# Altium schematic sheet GP_Power_Circuit_Sheet.SchDoc
size B; SheetNumber: 1; SheetTotal: 3
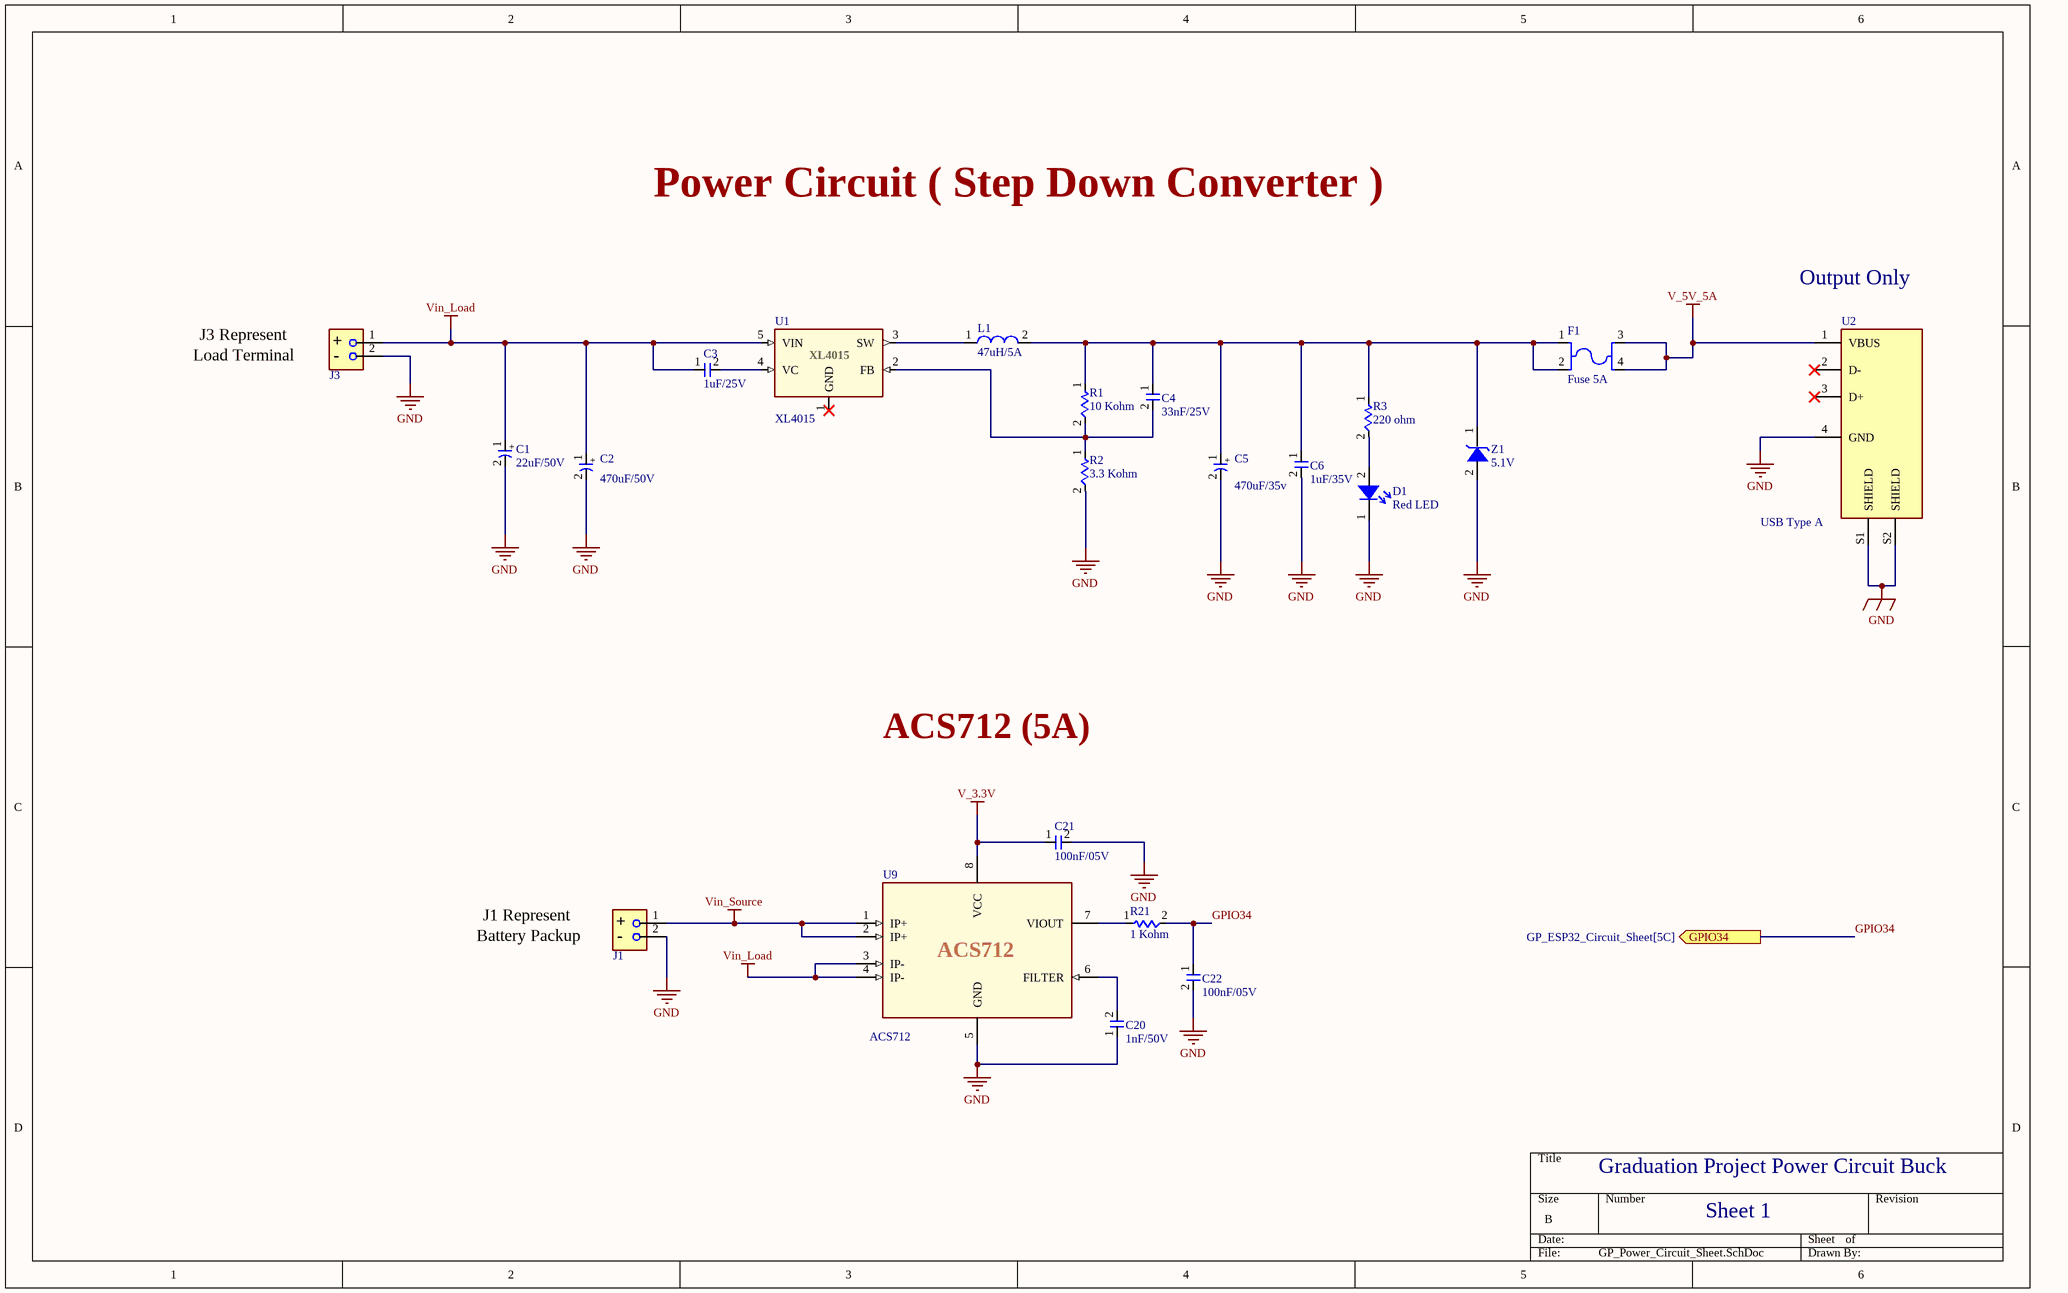
[diagram p0: GP_Power_Circuit_Sheet.SchDoc]

## Parts
C1  22uF/50V  [Electrolytic Capacitor 22UF]
C2  470uF/50V  [Capacitor 470uF/50v]
C3  1uF/25V  [Capacitor 1uF (1206)]
C4  33nF/25V  [Capacitor 33nF]
C5  470uF/35v  [Capacitor 470uF/35v]
C6  1uF/35V  [Capacitor 1uF (1206)]
C20  1nF/50V  [Capacitor 1nF]
C21  100nF/05V  [Capacitor 1uF (1206)]
C22  100nF/05V  [Capacitor 1uF (1206)]
D1  Red LED  [Red Led]
F1  Fuse 5A  [Fuse 5A]
J1  terminal block connector  [Battery Connector]  (value not drawn)
J3  terminal block connector  [Battery Connector]  (value not drawn)
L1  47uH/5A  [Inductor]
R1  10 Kohm  [Resistor 1Kohm]
R2  3.3 Kohm  [Resistor 1Kohm]
R3  220 ohm  [Resistor 1Kohm]
R21  1 Kohm  [Resistor 1Kohm]
U1  XL4015  [XL4015]
U2  USB Type A  [USB Type A]
U9  ACS712  [ACS712]
Z1  5.1V  [Zener Diode]

## Ports
GPIO34 (out, see GP_ESP32_Circuit_Sheet[5C])

## Nets
GND: C1.2(Pin_2) C2.2(Pin_2) C5.2(Pin_2) C6.2(Pin_2) C20.1(Pin_1) C21.2(Pin_2) C22.2(Pin_2) D1.1 J1.2 J3.2 R2.2(pin_2) U2.4(GND) U2.S1(SHIELD) U2.S2(SHIELD) U9.5(GND) Z1.2
V_3.3V: C21.1(Pin_1) U9.8(VCC)
V_5V_5A: F1.3(Pin_2) F1.4(Pin_1) U2.1(VBUS)
Vin_Load: C1.1(Pin_1) C2.1(Pin_1) C3.1(Pin_1) J3.1 U1.5(VIN) U9.3(IP-) U9.4(IP-)
Vin_Source: J1.1 U9.1(IP+) U9.2(IP+)
GPIO34: C22.1(Pin_1) R21.2(pin_2) ; port GPIO34
NetC3_2: C3.2(Pin_2) U1.4(VC)
NetC4_1: C4.1(Pin_1) C5.1(Pin_1) C6.1(Pin_1) F1.1(Pin_1) F1.2(Pin_2) L1.2 R1.1(Pin_1) R3.1(Pin_1) Z1.1
NetC4_2: C4.2(Pin_2) R1.2(pin_2) R2.1(Pin_1) U1.2(FB)
NetC20_2: C20.2(Pin_2) U9.6(FILTER)
NetD1_2: D1.2 R3.2(pin_2)
NetL1_1: L1.1 U1.3(SW)
NetR21_1: R21.1(Pin_1) U9.7(VIOUT)

Not connected (* = marked no-connect by the designer): U1 1(GND)*; U2 2(D-)* 3(D+)*

## Notes on the sheet
- Power Circuit ( Step Down Converter )
- (near U2) Output Only
- (near J3) Load Terminal
- J3 Represent
- ACS712 (5A)
- (near J1) Battery Packup
- J1 Represent
- Graduation Project Power Circuit Buck
- Sheet 1
- (in symbol Capacitor 470uF/35v) +
- (in symbol Capacitor 470uF/50v) +
- (in symbol Electrolytic Capacitor 22UF) +
- (in symbol Terminal Block) +; -

## Library data of the parts
C1 = Electrolytic Capacitor 22UF: Electrolytic Capacitor (22UF , 35V)SMD Radial Electrolytic Capacitor; ComponentLink1Description: Market Link; ComponentLink1URL: https://free-electronic.com/product/smd-electrolytic-capacitor-22uf-35v/
C2 = Capacitor 470uF/50v: Electrolytic Capacitor (470UF , 50V); ComponentLink1Description: Part Number; ComponentLink1URL: N/A; ComponentLink2Description: Market link; ComponentLink2URL: https://free-electronic.com/product/electrolytic-capacitor-470uf-50v/
C3 C6 C21 C22 = Capacitor 1uF: Ceramic Capacitor (1uF , 50V) SMD (1206)
C4 = Capacitor 33nF: Smd Chip Capacitor size 1206 33nF; ComponentLink1Description: Part Number; ComponentLink1URL: *; ComponentLink2Description: Market Link; ComponentLink2URL: https://uge-one.com/product/smd-chip-capacitor-size-1206-33nf/
C5 = Capacitor 470uF/35v: Electrolytic Capacitor (470UF , 35V); ComponentLink1Description: Part Number; ComponentLink1URL: N/A; ComponentLink2Description: Market Link; ComponentLink2URL: https://free-electronic.com/product/electrolytic-capacitor-470uf-35v/
C20 = Capacitor 1nF: Smd Chip Capacitor size 1206 1nF); ComponentLink1Description: Link; ComponentLink1URL: https://uge-one.com/product/smd-chip-capacitor-size-1206-1nf/
D1 = Red LED: 2012 Smd Led Red; ComponentLink1Description: Part Number; ComponentLink1URL: SM0603UYC; ComponentLink2Description: Market Link; ComponentLink2URL: https://free-electronic.com/product/2012-smd-led-red/
F1 = Fuse 5A: Glass Fuse T5 (5A-250V); Manufacturer Product Number: https://free-electronic.com/product/glass-fuse-t5-5a-250v/; ComponentLink1Description: Market Link; ComponentLink1URL: https://free-electronic.com/product/glass-fuse-t5-5a-250v/
J1 J3 = Terminal Block: 2-Pole 5mm Pitch PCB Mount Screw TermInal Block 8A 250V; ComponentLink1Description: Part Number; ComponentLink1URL: KF126-5.0-2P; ComponentLink2Description: Market link; ComponentLink2URL: https://free-electronic.com/product/terminal-block-2-pin-kf126-5-0-2p/
L1 = Inductor 47uH/5A: 47uH 5A Thorough hole Inductor is a passive electronic device widely used in electronic circuits. It is an insulated coil that is a wire wound on a ring-shaped form that is made of different materials, such as, powdered iron, ferrite, or another material.; ComponentLink1Description: Part Number; ComponentLink1URL: N/A; ComponentLink2Description: Market Link; ComponentLink2URL: https://free-electronic.com/product/xl4015-step-down-module-5a/
R1-R3 R21 = Resistor 1 Kohm: SMD RESISTORS 200V-500V 1206; ComponentLink1Description: Part Number; ComponentLink1URL: A1-20-1206-4.7K; ComponentLink2Description: Market Link; ComponentLink2URL: https://free-electronic.com/product/smd-resistor-1-kohm-1-4w/
U1 = XL4015: XL4015 Step Down Module (5A) Constant Current / Voltage LED Drives Lithium Battery Charging Module; ComponentLink1Description: Part Number; ComponentLink1URL: N/A; ComponentLink2Description: Market Link; ComponentLink2URL: https://uge-one.com/product/xl4015e1-5a-75w-adjustable-dc-dc-step-down-converter-regulator-ic-smd/
U9 = ACS712: AC/DC Current Sensor Module ACS712 (5A); Link: https://free-electronic.com/product/ac-dc-current-sensor-module-acs712-5a/
Z1 = Zener 5.1V: Zener Diodes ( 5.1V , 0.5w ); ComponentLink1Description: Market Link; ComponentLink1URL: https://free-electronic.com/product/bzx79c5v1/